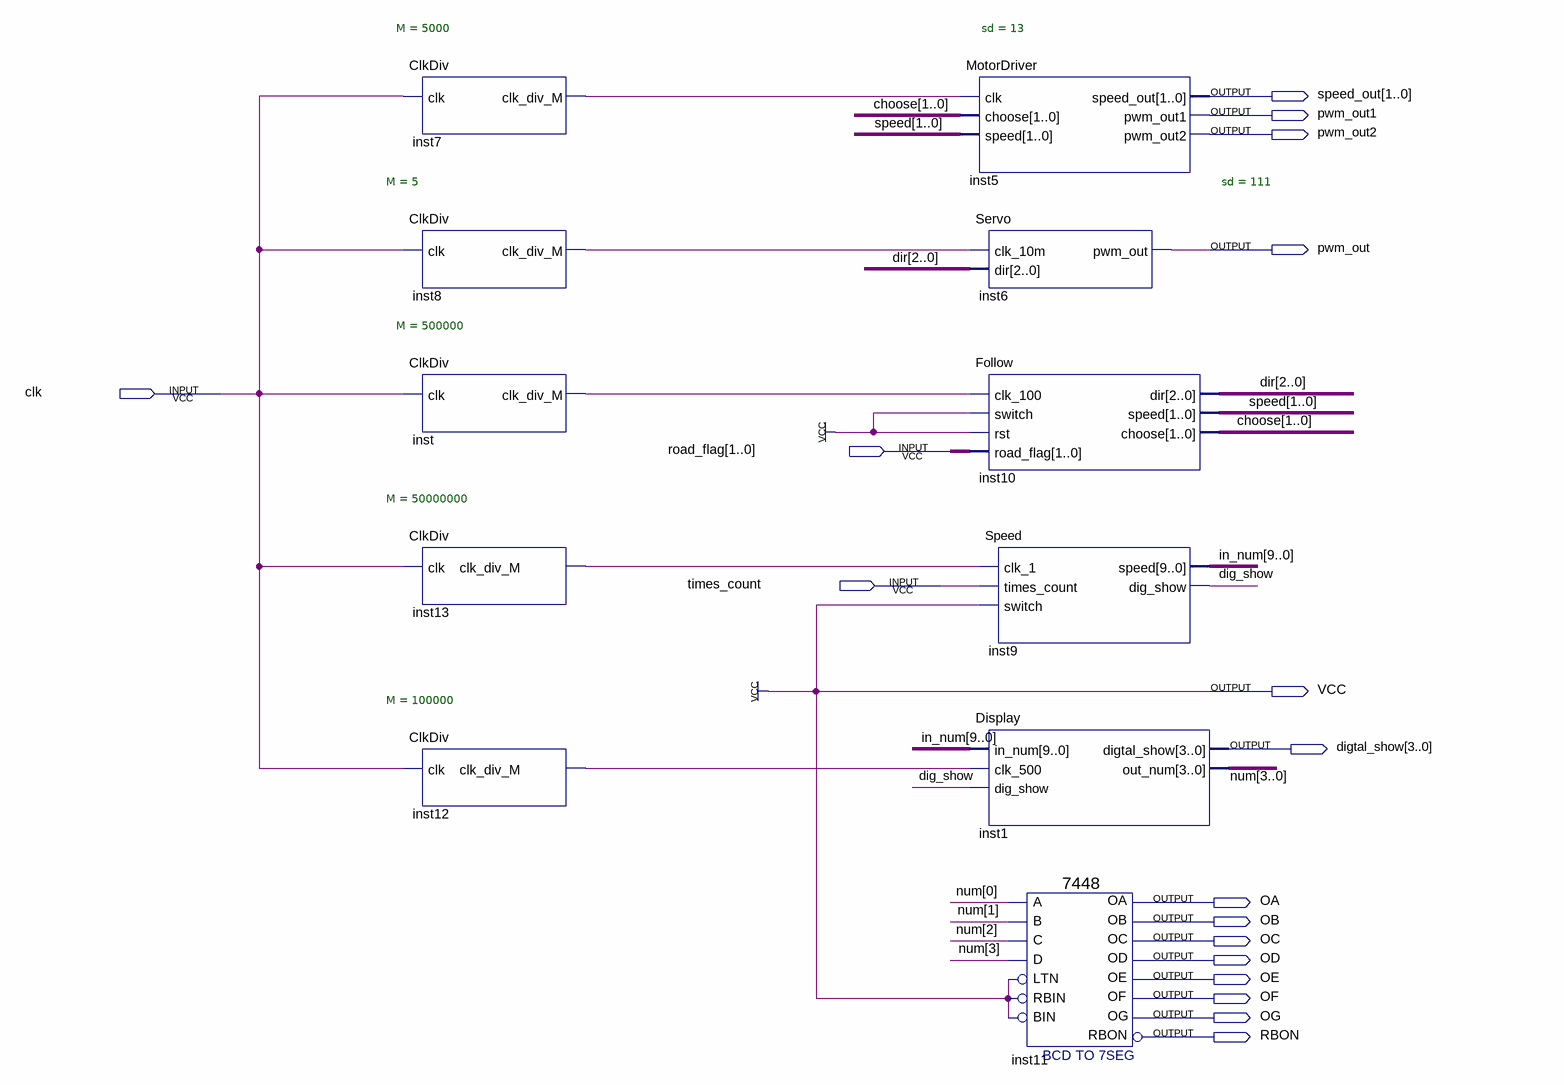
[diagram p0: schematic sheet]
// Quartus schematic FollowTest.bdf as structural Verilog: 11 symbols, 17 pins
module FollowTest (
  input  clk,
  input  [1:0] road_flag,
  input  times_count,
  output [1:0] speed_out,
  output pwm_out1,
  output pwm_out2,
  output pwm_out,
  output VCC,
  output [3:0] digtal_show,
  output OA,
  output OB,
  output OC,
  output OD,
  output OE,
  output OF,
  output OG,
  output RBON
);

  wire dig_show, inst7_clk_div_m, inst8_clk_div_m, inst12_clk_div_m, inst13_clk_div_m, inst_clk_div_m;
  wire [1:0] choose, speed;
  wire [2:0] dir;
  wire [3:0] num;
  wire [9:0] in_num;

  ClkDiv #(.M(5000)) inst7 (.clk(clk), .clk_div_M(inst7_clk_div_m));
  ClkDiv #(.M(5)) inst8 (.clk(clk), .clk_div_M(inst8_clk_div_m));
  ClkDiv #(.M(500000)) inst (.clk(clk), .clk_div_M(inst_clk_div_m));
  ClkDiv #(.M(50000000)) inst13 (.clk(clk), .clk_div_M(inst13_clk_div_m));
  ClkDiv #(.M(100000)) inst12 (.clk(clk), .clk_div_M(inst12_clk_div_m));
  MotorDriver #(.sd(13)) inst5 (
    .clk(inst7_clk_div_m), .choose(choose), .speed(speed), .speed_out(speed_out), .pwm_out1(pwm_out1),
    .pwm_out2(pwm_out2));
  Servo #(.sd(111)) inst6 (.clk_10m(inst8_clk_div_m), .dir(dir), .pwm_out(pwm_out));
  Follow inst10 (
    .clk_100(inst_clk_div_m), .switch(1'b1), .rst(1'b1), .road_flag(road_flag), .dir(dir), .speed(speed),
    .choose(choose));
  Speed inst9 (.clk_1(inst13_clk_div_m), .times_count(times_count), .switch(1'b1), .speed(in_num), .dig_show(dig_show));
  Display inst1 (
    .in_num(in_num), .clk_500(inst12_clk_div_m), .dig_show(dig_show), .digtal_show(digtal_show), .out_num(num));
  \7448  inst11 (
    .A(num[0]), .C(num[2]), .D(num[3]), .B(num[1]), .RBIN(1'b1), .BIN(1'b1), .LTN(1'b1), .OC(OC), .OE(OE),
    .OD(OD), .OF(OF), .OG(OG), .OB(OB), .OA(OA), .RBON(RBON));

  assign VCC = 1'b1;
endmodule
